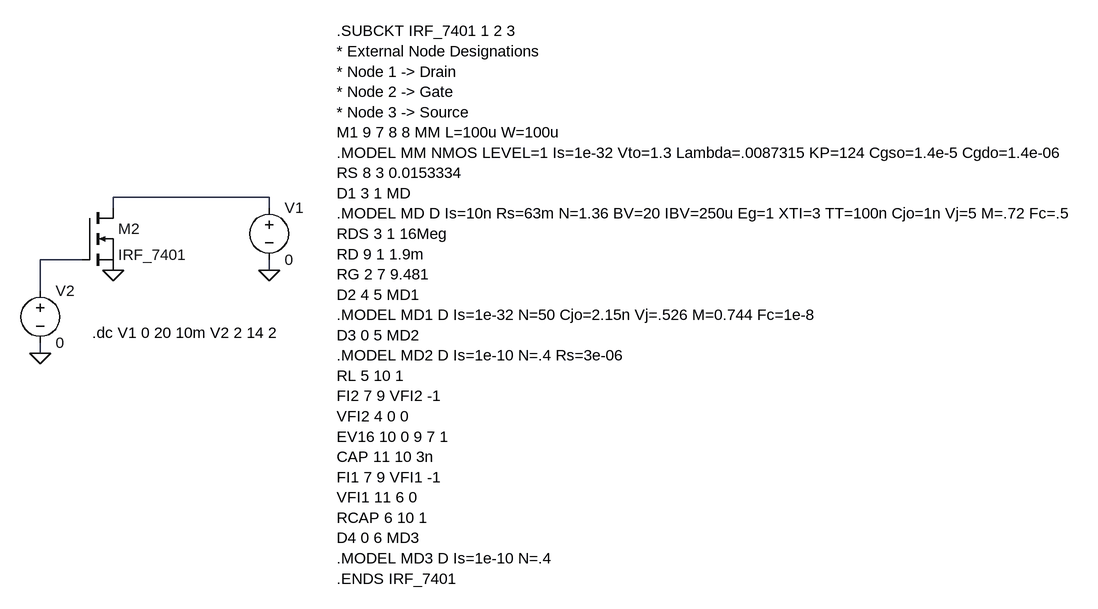
[diagram p0: schematic SubcktMOSFET.asc]
SubcktMOSFET.asc, the LTspice schematic file:
Version 4
SHEET 1 2892 1804
WIRE 480 -16 240 -16
WIRE 240 0 240 -16
WIRE 480 0 480 -16
WIRE 192 80 128 80
WIRE 480 96 480 80
WIRE 128 128 128 80
WIRE 128 224 128 208
FLAG 480 96 0
FLAG 128 224 0
FLAG 240 96 0
SYMBOL voltage 480 -16 R0
WINDOW 123 0 0 Left 0
WINDOW 39 0 0 Left 0
SYMATTR InstName V1
SYMATTR Value 0
SYMBOL voltage 128 112 R0
WINDOW 123 0 0 Left 0
WINDOW 39 0 0 Left 0
SYMATTR InstName V2
SYMATTR Value 0
SYMBOL nmos 192 0 R0
SYMATTR InstName M2
SYMATTR Value IRF_7401
SYMATTR Prefix X
TEXT 208 192 Left 0 !.dc V1 0 20 10m V2 2 14 2
TEXT 584 -272 Left 0 !.SUBCKT IRF_7401 1 2 3\n* External Node Designations\n* Node 1 -> Drain\n* Node 2 -> Gate\n* Node 3 -> Source\nM1 9 7 8 8 MM L=100u W=100u\n.MODEL MM NMOS LEVEL=1 Is=1e-32 Vto=1.3 Lambda=.0087315 KP=124 Cgso=1.4e-5 Cgdo=1.4e-06\nRS 8 3 0.0153334\nD1 3 1 MD\n.MODEL MD D Is=10n Rs=63m N=1.36 BV=20 IBV=250u Eg=1 XTI=3 TT=100n Cjo=1n Vj=5 M=.72 Fc=.5\nRDS 3 1 16Meg\nRD 9 1 1.9m\nRG 2 7 9.481\nD2 4 5 MD1\n.MODEL MD1 D Is=1e-32 N=50 Cjo=2.15n Vj=.526 M=0.744 Fc=1e-8\nD3 0 5 MD2\n.MODEL MD2 D Is=1e-10 N=.4 Rs=3e-06\nRL 5 10 1\nFI2 7 9 VFI2 -1\nVFI2 4 0 0\nEV16 10 0 9 7 1\nCAP 11 10 3n\nFI1 7 9 VFI1 -1\nVFI1 11 6 0\nRCAP 6 10 1\nD4 0 6 MD3\n.MODEL MD3 D Is=1e-10 N=.4\n.ENDS IRF_7401

The netlist it stands for:
* SubcktMOSFET.asc
V1 N001 0 0
V2 N002 0 0
XM2 N001 N002 0 IRF_7401  ; pins D G S
.dc V1 0 20 10m V2 2 14 2
.SUBCKT IRF_7401 1 2 3
* External Node Designations
* Node 1 -> Drain
* Node 2 -> Gate
* Node 3 -> Source
M1 9 7 8 8 MM L=100u W=100u
.MODEL MM NMOS LEVEL=1 Is=1e-32 Vto=1.3 Lambda=.0087315 KP=124 Cgso=1.4e-5 Cgdo=1.4e-06
RS 8 3 0.0153334
D1 3 1 MD
.MODEL MD D Is=10n Rs=63m N=1.36 BV=20 IBV=250u Eg=1 XTI=3 TT=100n Cjo=1n Vj=5 M=.72 Fc=.5
RDS 3 1 16Meg
RD 9 1 1.9m
RG 2 7 9.481
D2 4 5 MD1
.MODEL MD1 D Is=1e-32 N=50 Cjo=2.15n Vj=.526 M=0.744 Fc=1e-8
D3 0 5 MD2
.MODEL MD2 D Is=1e-10 N=.4 Rs=3e-06
RL 5 10 1
FI2 7 9 VFI2 -1
VFI2 4 0 0
EV16 10 0 9 7 1
CAP 11 10 3n
FI1 7 9 VFI1 -1
VFI1 11 6 0
RCAP 6 10 1
D4 0 6 MD3
.MODEL MD3 D Is=1e-10 N=.4
.ENDS IRF_7401
.backanno
.end